# Altium project BP1-1AA.PrjPcb (part 3 of 3)

## Sheet ON_OFF_Controller.SchDoc: On/Off Controller
size A3; CompanyName: FSCH; DrawnBy: ahorat / daniw; Engineer: ahorat / daniw; Address1: FS Switzerland; Address2: Zeltweg 57; Address3: 8032 Zürich; SheetNumber: 9; SheetTotal: 9
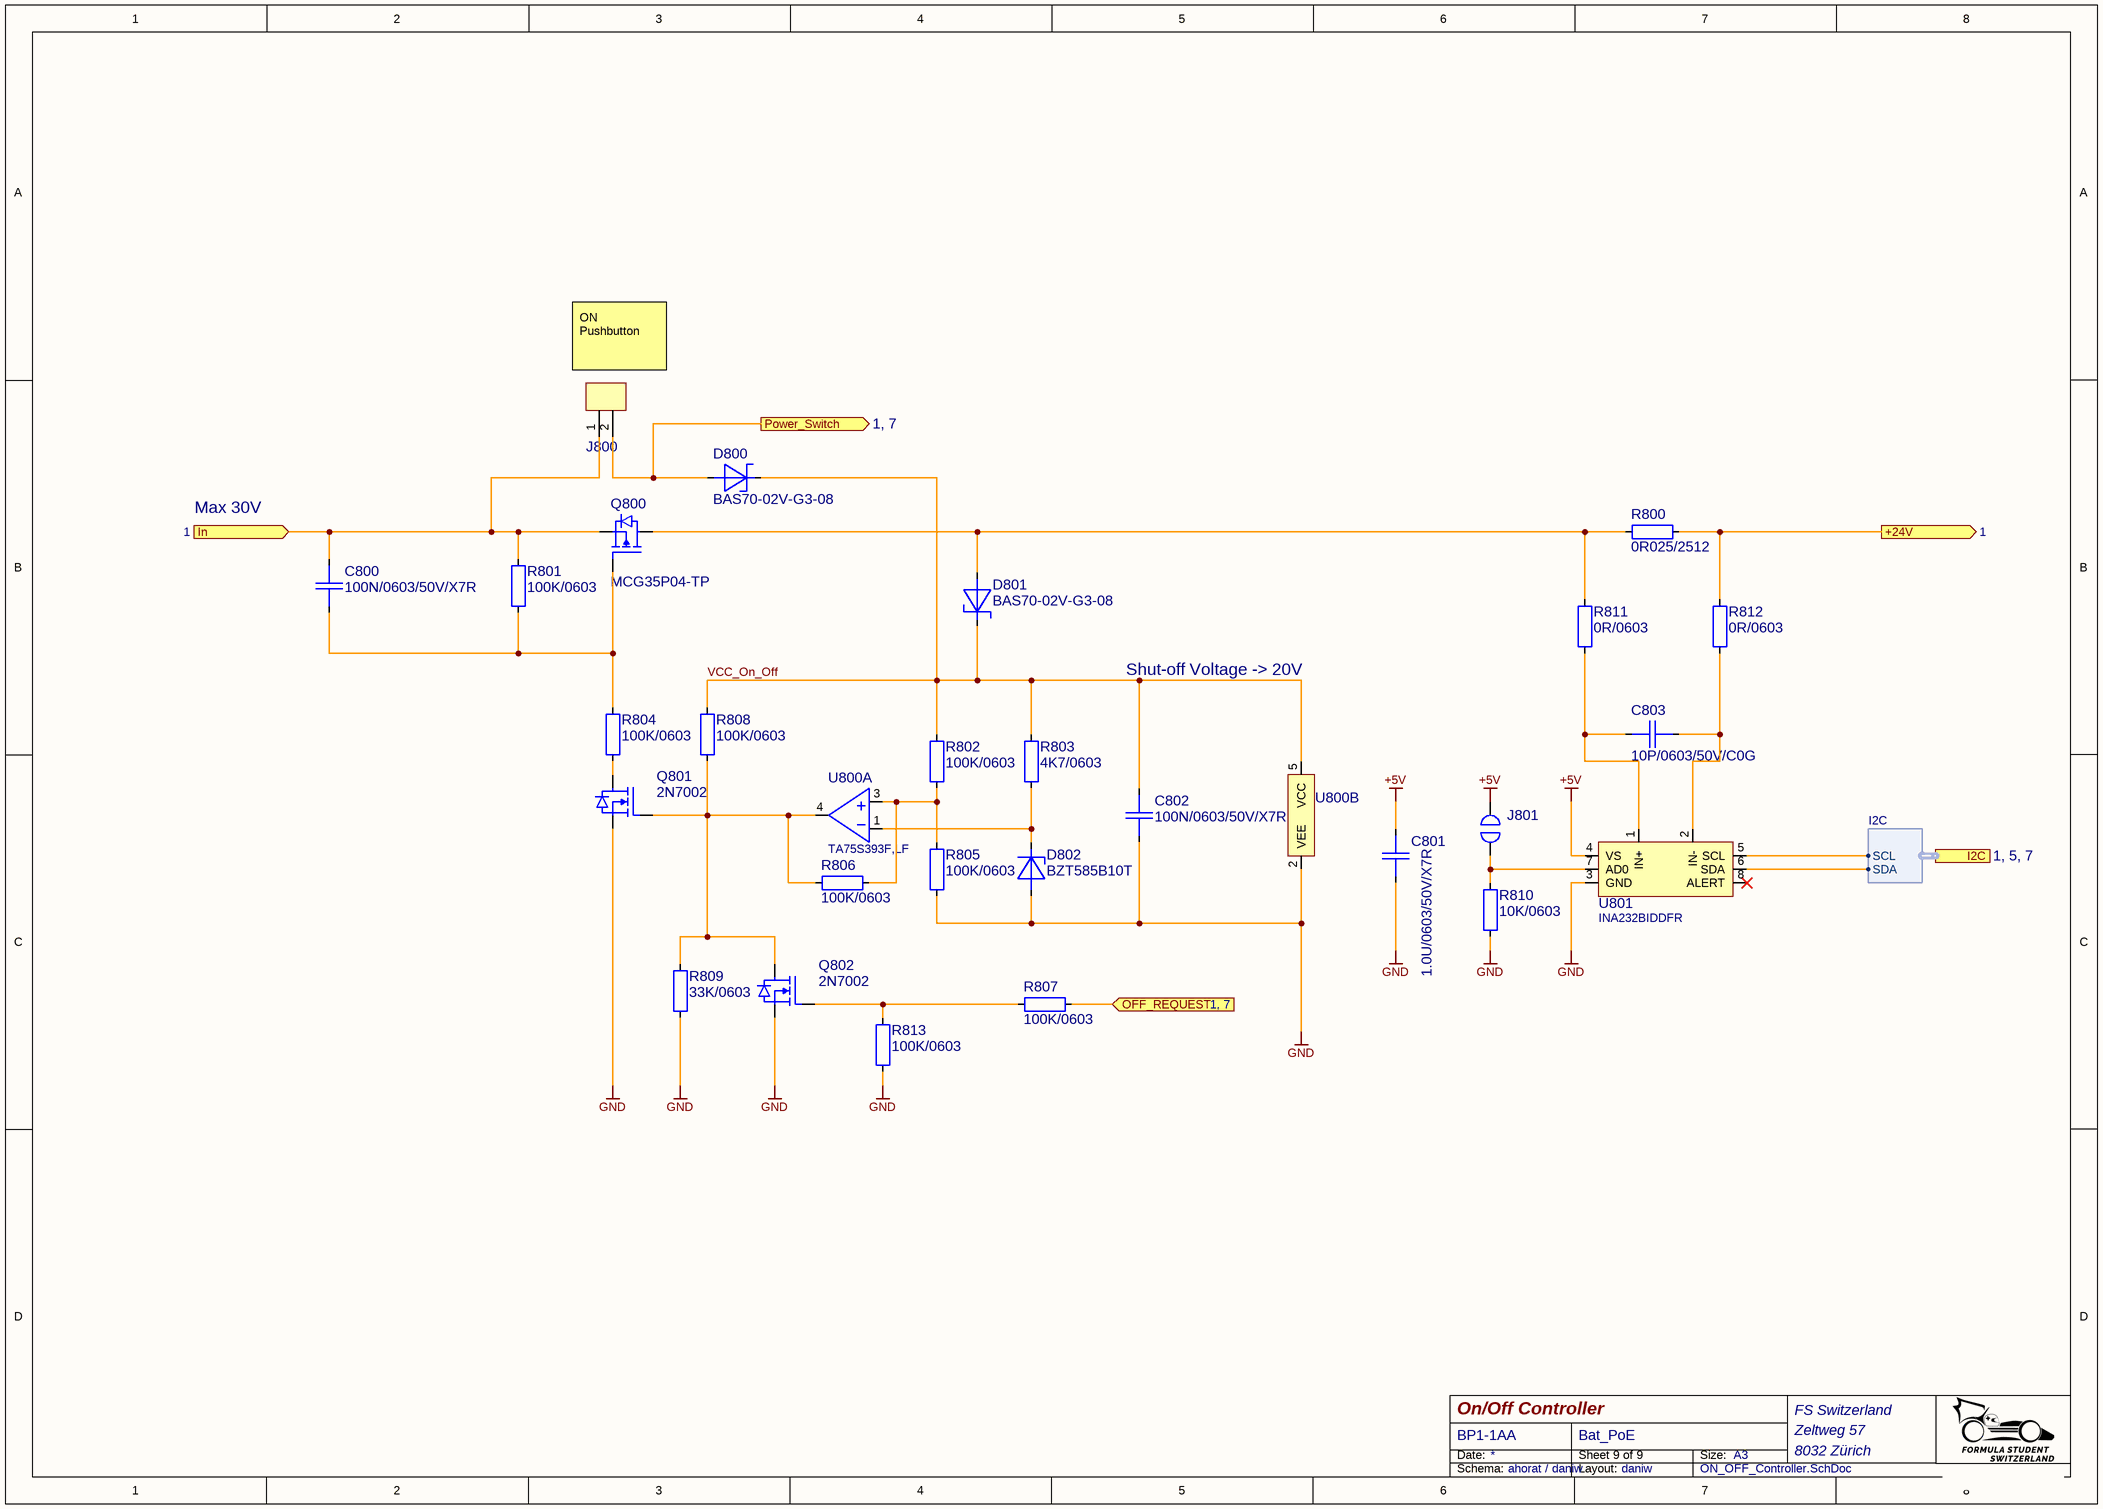
[diagram p9: ON_OFF_Controller.SchDoc]

### Parts
C800  100N/0603/50V/X7R  [CAP0603_X7R]
C801  1.0U/0603/50V/X7R  [CAP0603_X7R]
C802  100N/0603/50V/X7R  [CAP0603_X7R]
C803  10P/0603/50V/C0G  [CAP0603_C0G]
D800  BAS70-02V-G3-08  [SOD1608X065]
D801  BAS70-02V-G3-08  [SOD1608X065]
D802  BZT585B10T  [SOD1608X065]
J800  5600200220  [5600200220]  (value not drawn)
J801  Solder Jumper 2pin 0.2mm small  [Solder_Jumper_2pin_0.2mm_small]  (value not drawn)
Q800  MCG35P04-TP  [SON065P330X330X075-5-TH245X175]
Q801  2N7002  [SOT2395P280X125-3-SE]
Q802  2N7002  [SOT2395P280X125-3-SE]
R800  0R025/2512  [R2512-0.65-WW]
R801  100K/0603  [R0603-0.40-WW]
R802  100K/0603  [R0603-0.40-WW]
R803  4K7/0603  [R0603-0.40-WW]
R804  100K/0603  [R0603-0.40-WW]
R805  100K/0603  [R0603-0.40-WW]
R806  100K/0603  [R0603-0.40-WW]
R807  100K/0603  [R0603-0.40-WW]
R808  100K/0603  [R0603-0.40-WW]
R809  33K/0603  [R0603-0.40-WW]
R810  10K/0603  [R0603-0.40-WW]
R811  0R/0603  [R0603-0.40-WW]
R812  0R/0603  [R0603-0.40-WW]
R813  100K/0603  [R0603-0.40-WW]
U800  TA75S393F,LF  [SOT2395P280X125-5-SW]  (parts A,B of 2)
U801  INA232BIDDFR  [SOT065P280X110-8-SE]

### Ports
+24V (out, see 1), I2C (harness I2C, see 1, 5, 7), In (in, see 1), OFF_REQUEST (in, see 1, 7), Power_Switch (out, see 1, 7)

### Harnesses
I2C: SDA, SCL

### Nets
+5V: C801.1 J801.1 U801.4(VS)
+24V: R800.2 R812.1 ; port +24V
GND: C801.2 C802.2 D802.2 Q801.2(SOURCE) Q802.2(SOURCE) R805.2 R809.2 R810.2 R813.2 U800.2(VEE) U801.3(GND)
I2C.SCL: U801.5(SCL) ; port I2C.SCL
I2C.SDA: U801.6(SDA) ; port I2C.SDA
VCC_On_Off: C802.1 D800.1 D801.1 R802.1 R803.1 R808.1 U800.5(VCC)
NetC200_Charger_Upper_1: C800.1 J800.1 Q800.S(SOURCE) R801.1 ; port In
NetC604_1: R807.1 ; port OFF_REQUEST
NetC800_2: C800.2 Q800.G(GATE) R801.2 R804.1
NetC803_1: C803.1 R812.2 U801.2(IN-)
NetC803_2: C803.2 R811.2 U801.1(IN+)
NetD800_2: D800.2 J800.2 ; port Power_Switch
NetD801_2: D801.2 Q800.D(DRAIN) R800.1 R811.1
NetD802_1: D802.1 R803.2 U800.1(IN-)
NetJ801_2: J801.2 R810.1 U801.7(AD0)
NetQ801_1: Q801.1(GATE) Q802.3(DRAIN) R806.2 R808.2 R809.1 U800.4(OUT)
NetQ801_3: Q801.3(DRAIN) R804.2
NetQ802_1: Q802.1(GATE) R807.2 R813.1
NetR802_2: R802.2 R805.1 R806.1 U800.3(IN+)

Not connected (* = marked no-connect by the designer): U801 8(ALERT)*

### Notes on the sheet
- (near J800) ON Pushbutton
- Max 30V
- Shut-off Voltage -> 20V
- Date:
- Size:
- A3
- Schema:
- Layout:

### Library data of the parts
C800 C802 = 100N/0603/50V/X7R: CAP SM 0603 100nF 50V X7R; Manufacturer: GENERIC; Manufacturer 1: YAGEO; Manufacturer Part Number 1: CC0603KPX7R9BB104; Absolute Value: 1E-7; Eurocircuits GPN: GPC0603104; Part Number: 100N/0603/50V/X7R; Package: 0603; Value: 100nF; HelpURL: https://www.yageo.com/upload/media/product/app/datasheet/mlcc/upy-gphc_x7r_6_3v-to-250v.pdf; Supplier 1: Digi-Key; Supplier Part Number 1: 311-3567-1-ND; Manufacturer 2: YAGEO; Manufacturer Part Number 2: CC0603MRX7R9BB104; Supplier 2: Digi-Key; Supplier Part Number 2: 311-4110-1-ND; Supplier 3: LCSC; Supplier Part Number 3: C14663; JLC Type: Basic
C801 = 1.0U/0603/50V/X7R: CAP SM 0603 1.0uF 50V X7R; Manufacturer: GENERIC; Manufacturer 1: YAGEO; Manufacturer Part Number 1: CC0603KRX7R9BB105; Absolute Value: 1E-6; Eurocircuits GPN: GPC0603105; Part Number: 1.0U/0603/50V/X7R; Package: 0603; Value: 1.0uF; HelpURL: https://www.yageo.com/upload/media/product/app/datasheet/mlcc/upy-gphc_x7r_6_3v-to-250v.pdf; Supplier 1: Digi-Key; Supplier Part Number 1: 311-2082-1-ND
C803 = 10P/0603/50V/C0G: CAP SM 0603 10pF 50V C0G; Manufacturer: GENERIC; Manufacturer 1: YAGEO; Manufacturer Part Number 1: CC0603JRNPO9BN100; Absolute Value: 1E-11; Eurocircuits GPN: GPC0603100-C0G; Part Number: 10P/0603/50V/C0G; Package: 0603; Value: 10pF; HelpURL: https://www.yageo.com/upload/media/product/productsearch/datasheet/mlcc/UPY-GP_NP0_16V-to-50V_18.pdf; Supplier 1: Digi-Key; Supplier Part Number 1: 311-1058-1-ND; Manufacturer 2: YAGEO; Manufacturer Part Number 2: CC0603KRNPO9BN100; Supplier 2: Digi-Key; Supplier Part Number 2: 311-4025-1-ND
D800 D801 = BAS70-02V-G3-08: Small Signal Schottky Diode; Manufacturer: Vishay; Manufacturer 1: Vishay General Semiconductor - Diodes Division; Value: 70V/100mA; Absolute Value: 70V; Part Number: BAS70-02V-G3-08; Package: SOD523; HelpURL: https://www.vishay.com/docs/85652/bas70-02v.pdf; Manufacturer 3: Vishay Intertech; Manufacturer Part Number 3: BAS70-02V-G3-08; Supplier 3: LCSC; Supplier Part Number 3: C3313114; JLC Type: Extended; Manufacturer Part Number 1: BAS70-02V-G3-08; Supplier 1: Digikey; Supplier Part Number 1: 112-BAS70-02V-G3-08CT-ND
D802 = BZT585B10T: DIODE ZENER 10V 350MW SOD523; Manufacturer: Diodes Incorporated; Manufacturer Part Number 1: BZT585B10T-7; Part Number: BZT585B10T; Package: SC-79, SOD-523; Value: BZT585B10T; Absolute Value: 10 V; HelpURL: https://www.diodes.com/assets/Datasheets/BZT585BxVxT.pdf; Manufacturer 1: Diodes Incorporated; Supplier 1: Digikey; Supplier Part Number 1: BZT585B10T-7DICT-ND
J800 = DuraClick_1x2_VERT_SMD: DuraClik Wire-to-Board Header, Single Row, Vertical, 2 Circuits, Tin (Sn) Over Nickel, Natural; Manufacturer 1: Molex; Part Number: DuraClick_1x2_VERT_SMD; HelpURL: https://www.molex.com/en-us/products/part-detail/5600200220; Manufacturer Part Number 1: 5600200220; Supplier 1: Digi-Key; Supplier Part Number 1: WM10862CT-ND; Manufacturer: Molex
J801 = Solder_Jumper_2pin_0.2mm_small: Solder jumper with two pins with a spacing of 0.2mm; Manufacturer: NONE; Part Number: Solder_Jumper_2pin_0.2mm_small
Q800 = MCG35P04-TP: 40V 35A P-Channel MOSFET; Manufacturer: Micro Commercial Co; Manufacturer Part Number 1: 353-MCG35P04-TPCT-ND; Part Number: MCG35P04-TP; HelpURL: https://www.mccsemi.com/pdf/Products/MCG35P04(DFN3333).pdf; Manufacturer 1: Micro Commercial Co; Supplier 1: Digi-Key; Supplier Part Number 1: 353-MCG35P04-TPCT-ND; Package: 8-PowerVDFN
Q801 Q802 = 2N7002: 60V 115mA 1.2Ω@10V,500mA 200mW 2.1V@250uA N Channel SOT-23 MOSFETs; Manufacturer: GENERIC; Manufacturer 1: Nexperia USA Inc.; Manufacturer Part Number 1: 2N7002NXAKR; Part Number: 2N7002; Package: SOT23; HelpURL: https://assets.nexperia.com/documents/data-sheet/2N7002NXAK.pdf; Supplier 1: Digi-Key; Supplier Part Number 1: 1727-8643-1-ND; Manufacturer 3: JSMSEMI; Manufacturer Part Number 3: JSMSEMI; Supplier 3: LCSC; Supplier Part Number 3: C916396; JLC Type: Extended
R800 = 0R025/2512: RES SM 2512 0R025; Manufacturer: GENERIC; Manufacturer 1: Ohmite; Manufacturer Part Number 1: MCS3264R025FER; Absolute Value: 0.025; Part Number: 0R025/2512; Package: 2512; Value: 0R025; HelpURL: https://www.ohmite.com/assets/docs/res_mcs.pdf?r=false; Supplier 1: Digi-Key; Supplier Part Number 1: MCS3264R025FERCT-ND
R801 R802 R804-R808 R813 = 100K/0603: RES SM 0603 100K; Manufacturer: GENERIC; Manufacturer 1: YAGEO; Manufacturer Part Number 1: RC0603FR-13100KL; Absolute Value: 100000; Eurocircuits GPN: GPR0603100K; Part Number: 100K/0603; Package: 0603; Value: 100K; HelpURL: https://www.yageo.com/upload/media/product/productsearch/datasheet/rchip/PYu-RC_Group_51_RoHS_L_12.pdf; Supplier 1: Digi-Key; Supplier Part Number 1: 13-RC0603FR-13100KLCT-ND; Manufacturer 2: YAGEO; Manufacturer Part Number 2: RC0603FR-10100KL; Supplier 2: Digi-Key; Supplier Part Number 2: 13-RC0603FR-10100KLCT-ND; Manufacturer 3: UNI-ROYAL(Uniroyal Elec); Manufacturer Part Number 3: 0603WAF1003T5E; Supplier 3: LCSC; Supplier Part Number 3: C25803; JLC Type: Basic
R803 = 4K7/0603: RES SM 0603 4K7; Manufacturer: GENERIC; Manufacturer 1: YAGEO; Manufacturer Part Number 1: RC0603FR-134K7L; Absolute Value: 4700; Eurocircuits GPN: GPR06034K7; Part Number: 4K7/0603; Package: 0603; Value: 4K7; HelpURL: https://www.yageo.com/upload/media/product/app/datasheet/rchip/pyu-rc_group_51_rohs_l.pdf; Supplier 1: Digi-Key; Supplier Part Number 1: 13-RC0603FR-134K7LCT-ND; Manufacturer 2: YAGEO; Manufacturer Part Number 2: RC0603FR-104K7L; Supplier 2: Digi-Key; Supplier Part Number 2: 13-RC0603FR-104K7LCT-ND; Manufacturer 3: UNI-ROYAL(Uniroyal Elec); Manufacturer Part Number 3: 0603WAF4701T5E; Supplier 3: LCSC; Supplier Part Number 3: C23162; JLC Type: Basic
R809 = 33K/0603: RES SM 0603 33K; Manufacturer: GENERIC; Manufacturer 1: YAGEO; Manufacturer Part Number 1: RC0603FR-1333KL; Absolute Value: 33000; Eurocircuits GPN: GPR060333K; Part Number: 33K/0603; Package: 0603; Value: 33K; HelpURL: https://www.yageo.com/upload/media/product/app/datasheet/rchip/pyu-rc_group_51_rohs_l.pdf; Supplier 1: Digi-Key; Supplier Part Number 1: 13-RC0603FR-1333KLCT-ND; Manufacturer 2: YAGEO; Manufacturer Part Number 2: RC0603FR-1033KL; Supplier 2: Digi-Key; Supplier Part Number 2: 13-RC0603FR-1033KLCT-ND
R810 = 10K/0603: RES SM 0603 10K; Manufacturer: GENERIC; Manufacturer 1: YAGEO; Manufacturer Part Number 1: RC0603FR-1310KL; Absolute Value: 10000; Eurocircuits GPN: GPR060310K; Part Number: 10K/0603; Package: 0603; Value: 10K; HelpURL: https://www.yageo.com/upload/media/product/productsearch/datasheet/rchip/PYu-RC_Group_51_RoHS_L_12.pdf; Supplier 1: Digi-Key; Supplier Part Number 1: 13-RC0603FR-1310KLCT-ND; Manufacturer 2: YAGEO; Manufacturer Part Number 2: RC0603FR-1010KL; Supplier 2: Digi-Key; Supplier Part Number 2: 13-RC0603FR-1010KLCT-ND; Manufacturer 3: UNI-ROYAL(Uniroyal Elec); Manufacturer Part Number 3: 0603WAF1002T5E; Supplier 3: LCSC; Supplier Part Number 3: C25804; JLC Type: Basic
R811 R812 = 0R/0603: RES SM 0603 0R; Manufacturer: GENERIC; Manufacturer 1: YAGEO; Manufacturer Part Number 1: RC0603FR-070RL; Absolute Value: 0; Eurocircuits GPN: GPR06030R; Part Number: 0R/0603; Package: 0603; Value: 0R; HelpURL: https://www.yageo.com/upload/media/product/app/datasheet/rchip/pyu-rc_group_51_rohs_l.pdf; Supplier 1: Digi-Key; Supplier Part Number 1: 311-0.0HRCT-ND; Manufacturer 2: YAGEO; Manufacturer Part Number 2: RC0603FR-130RL; Supplier 2: Digi-Key; Supplier Part Number 2: 13-RC0603FR-130RLCT-ND; Manufacturer 3: UNI-ROYAL(Uniroyal Elec); Manufacturer Part Number 3: 0603WAF0000T5E; Supplier 3: LCSC; Supplier Part Number 3: C21189; JLC Type: Basic
U800 = TA75S393F,LF: 36V Single Voltage Comparator; Manufacturer: Toshiba Semiconductor and Storage; Part Number: TA75S393F,LF; Package: SOT23-5; HelpURL: https://toshiba.semicon-storage.com/info/TA75S393F_datasheet_en_20220525.pdf?did=20981&prodName=TA75S393F; Manufacturer 1: Toshiba Semiconductor and Storage; Manufacturer Part Number 1: TA75S393F,LF; Supplier 1: Digi-Key; Supplier Part Number 1: TA75S393FLFCT-ND; Manufacturer 3: TOSHIBA; Manufacturer Part Number 3: TA75S393F,LF(T; Supplier 3: LCSC; Supplier Part Number 3: C840438
U801 = INA232BIDDFR: INA232 48-V, 16-Bit, Current, Voltage, and Power Monitor With an I2C Interface; Manufacturer: Texas Instruments; Part Number: INA232BIDDFR; Package: SOT23-8; HelpURL: https://www.ti.com/lit/ds/symlink/ina232.pdf; Manufacturer 1: Texas Instruments; Manufacturer Part Number 1: INA232BIDDFR; Supplier 1: Digi-Key; Supplier Part Number 1: 296-INA232BIDDFRCT-ND

## Nets that join several sheets
+5V: Interfaces (D600.5 J600.2 J600.4 J601.1), RPI_Supply (7 pins), ON_OFF_Controller (C801.1 J801.1 U801.4)
+24V: DC_DC_Converter (C300.1 L300.1), PoE_Injector (8 pins), Interfaces (J602.1 J604.1 J605.1 J606.1), RPI_Supply (6 pins), ON_OFF_Controller (R800.2 R812.1)
+48V: DC_DC_Converter (C307.1 C308.1 C309.1 L302.2), PoE_Injector (C400.1 C401.1 U400.22), Ethernet Channel 1 (C510_Ethernet_Channel_1.1 D501_Ethernet_Channel_1.1 J502_Ethernet_Channel_1.1 J504_Ethernet_Channel_1.1), Ethernet Channel 2 (C510_Ethernet_Channel_2.1 D501_Ethernet_Channel_2.1 J502_Ethernet_Channel_2.1 J504_Ethernet_Channel_2.1), Ethernet Channel 3 (C510_Ethernet_Channel_3.1 D501_Ethernet_Channel_3.1 J502_Ethernet_Channel_3.1 J504_Ethernet_Channel_3.1), Ethernet Channel 4 (C510_Ethernet_Channel_4.1 D501_Ethernet_Channel_4.1 J502_Ethernet_Channel_4.1 J504_Ethernet_Channel_4.1), Interfaces (J603.1)
GND: Charger Lower (36 pins), DC_DC_Converter (23 pins), PoE_Injector (23 pins), Mains (5 pins), Ethernet Channel 1 (C508_Ethernet_Channel_1.2 C509_Ethernet_Channel_1.2 J500_Ethernet_Channel_1.9 J501_Ethernet_Channel_1.9), Ethernet Channel 2 (C508_Ethernet_Channel_2.2 C509_Ethernet_Channel_2.2 J500_Ethernet_Channel_2.9 J501_Ethernet_Channel_2.9), Ethernet Channel 3 (C508_Ethernet_Channel_3.2 C509_Ethernet_Channel_3.2 J500_Ethernet_Channel_3.9 J501_Ethernet_Channel_3.9), Ethernet Channel 4 (C508_Ethernet_Channel_4.2 C509_Ethernet_Channel_4.2 J500_Ethernet_Channel_4.9 J501_Ethernet_Channel_4.9), Interfaces (25 pins), RPI_Supply (10 pins), ON_OFF_Controller (11 pins)
GND_BAT: Charger Upper (36 pins), Charger Lower (8 pins), Mains (C100.2 C101.2 R102.2 U100.4)
I2C.SCL: PoE_Injector (U400.9), Interfaces (C601.1 D600.3 R603.1), ON_OFF_Controller (U801.5)
I2C.SDA: PoE_Injector (U400.10 U400.11), Interfaces (C600.1 D600.1 R602.1), ON_OFF_Controller (U801.6)
NetC100_1: Charger Upper (Q200_Charger_Upper.D), Mains (C100.1 C101.1 L100.2 R102.1)
NetC102_1: Charger Lower (Q200_Charger_Lower.D), Mains (C102.1 C103.1 L102.2 R103.1)
NetC200_Charger_Upper_1: Charger Upper (8 pins), ON_OFF_Controller (C800.1 J800.1 Q800.S R801.1)
NetC510_Ethernet_Channel_1_2: PoE_Injector (Q400.D U400.2), Ethernet Channel 1 (C510_Ethernet_Channel_1.2 D501_Ethernet_Channel_1.2 J503_Ethernet_Channel_1.1 J505_Ethernet_Channel_1.1)
NetC510_Ethernet_Channel_2_2: PoE_Injector (Q401.D U400.31), Ethernet Channel 2 (C510_Ethernet_Channel_2.2 D501_Ethernet_Channel_2.2 J503_Ethernet_Channel_2.1 J505_Ethernet_Channel_2.1)
NetC510_Ethernet_Channel_3_2: PoE_Injector (Q402.D U400.28), Ethernet Channel 3 (C510_Ethernet_Channel_3.2 D501_Ethernet_Channel_3.2 J503_Ethernet_Channel_3.1 J505_Ethernet_Channel_3.1)
NetC510_Ethernet_Channel_4_2: PoE_Injector (Q403.D U400.25), Ethernet Channel 4 (C510_Ethernet_Channel_4.2 D501_Ethernet_Channel_4.2 J503_Ethernet_Channel_4.1 J505_Ethernet_Channel_4.1)
NetC604_1: Interfaces (C604.1 D600.6 R604.1), ON_OFF_Controller (R807.1)
NetD600_4: DC_DC_Converter (U300.14), Interfaces (D600.4 J600.18 R608.2)
NetD800_2: Interfaces (R606.1), ON_OFF_Controller (D800.2 J800.2)

## Assembly variants
DownloadStation: not fitted C221_Charger Lower C221_Charger Upper R806